# Altium schematic sheet Power_supply_CAN.SchDoc
size 420 x 297 mm; Address1: Address1; Address2: Address2; Address3: Address3; Address4: Address4; DocumentNumber: *Э3; SheetNumber: 7; SheetTotal: 15; DocumentType: Схема электрическая *
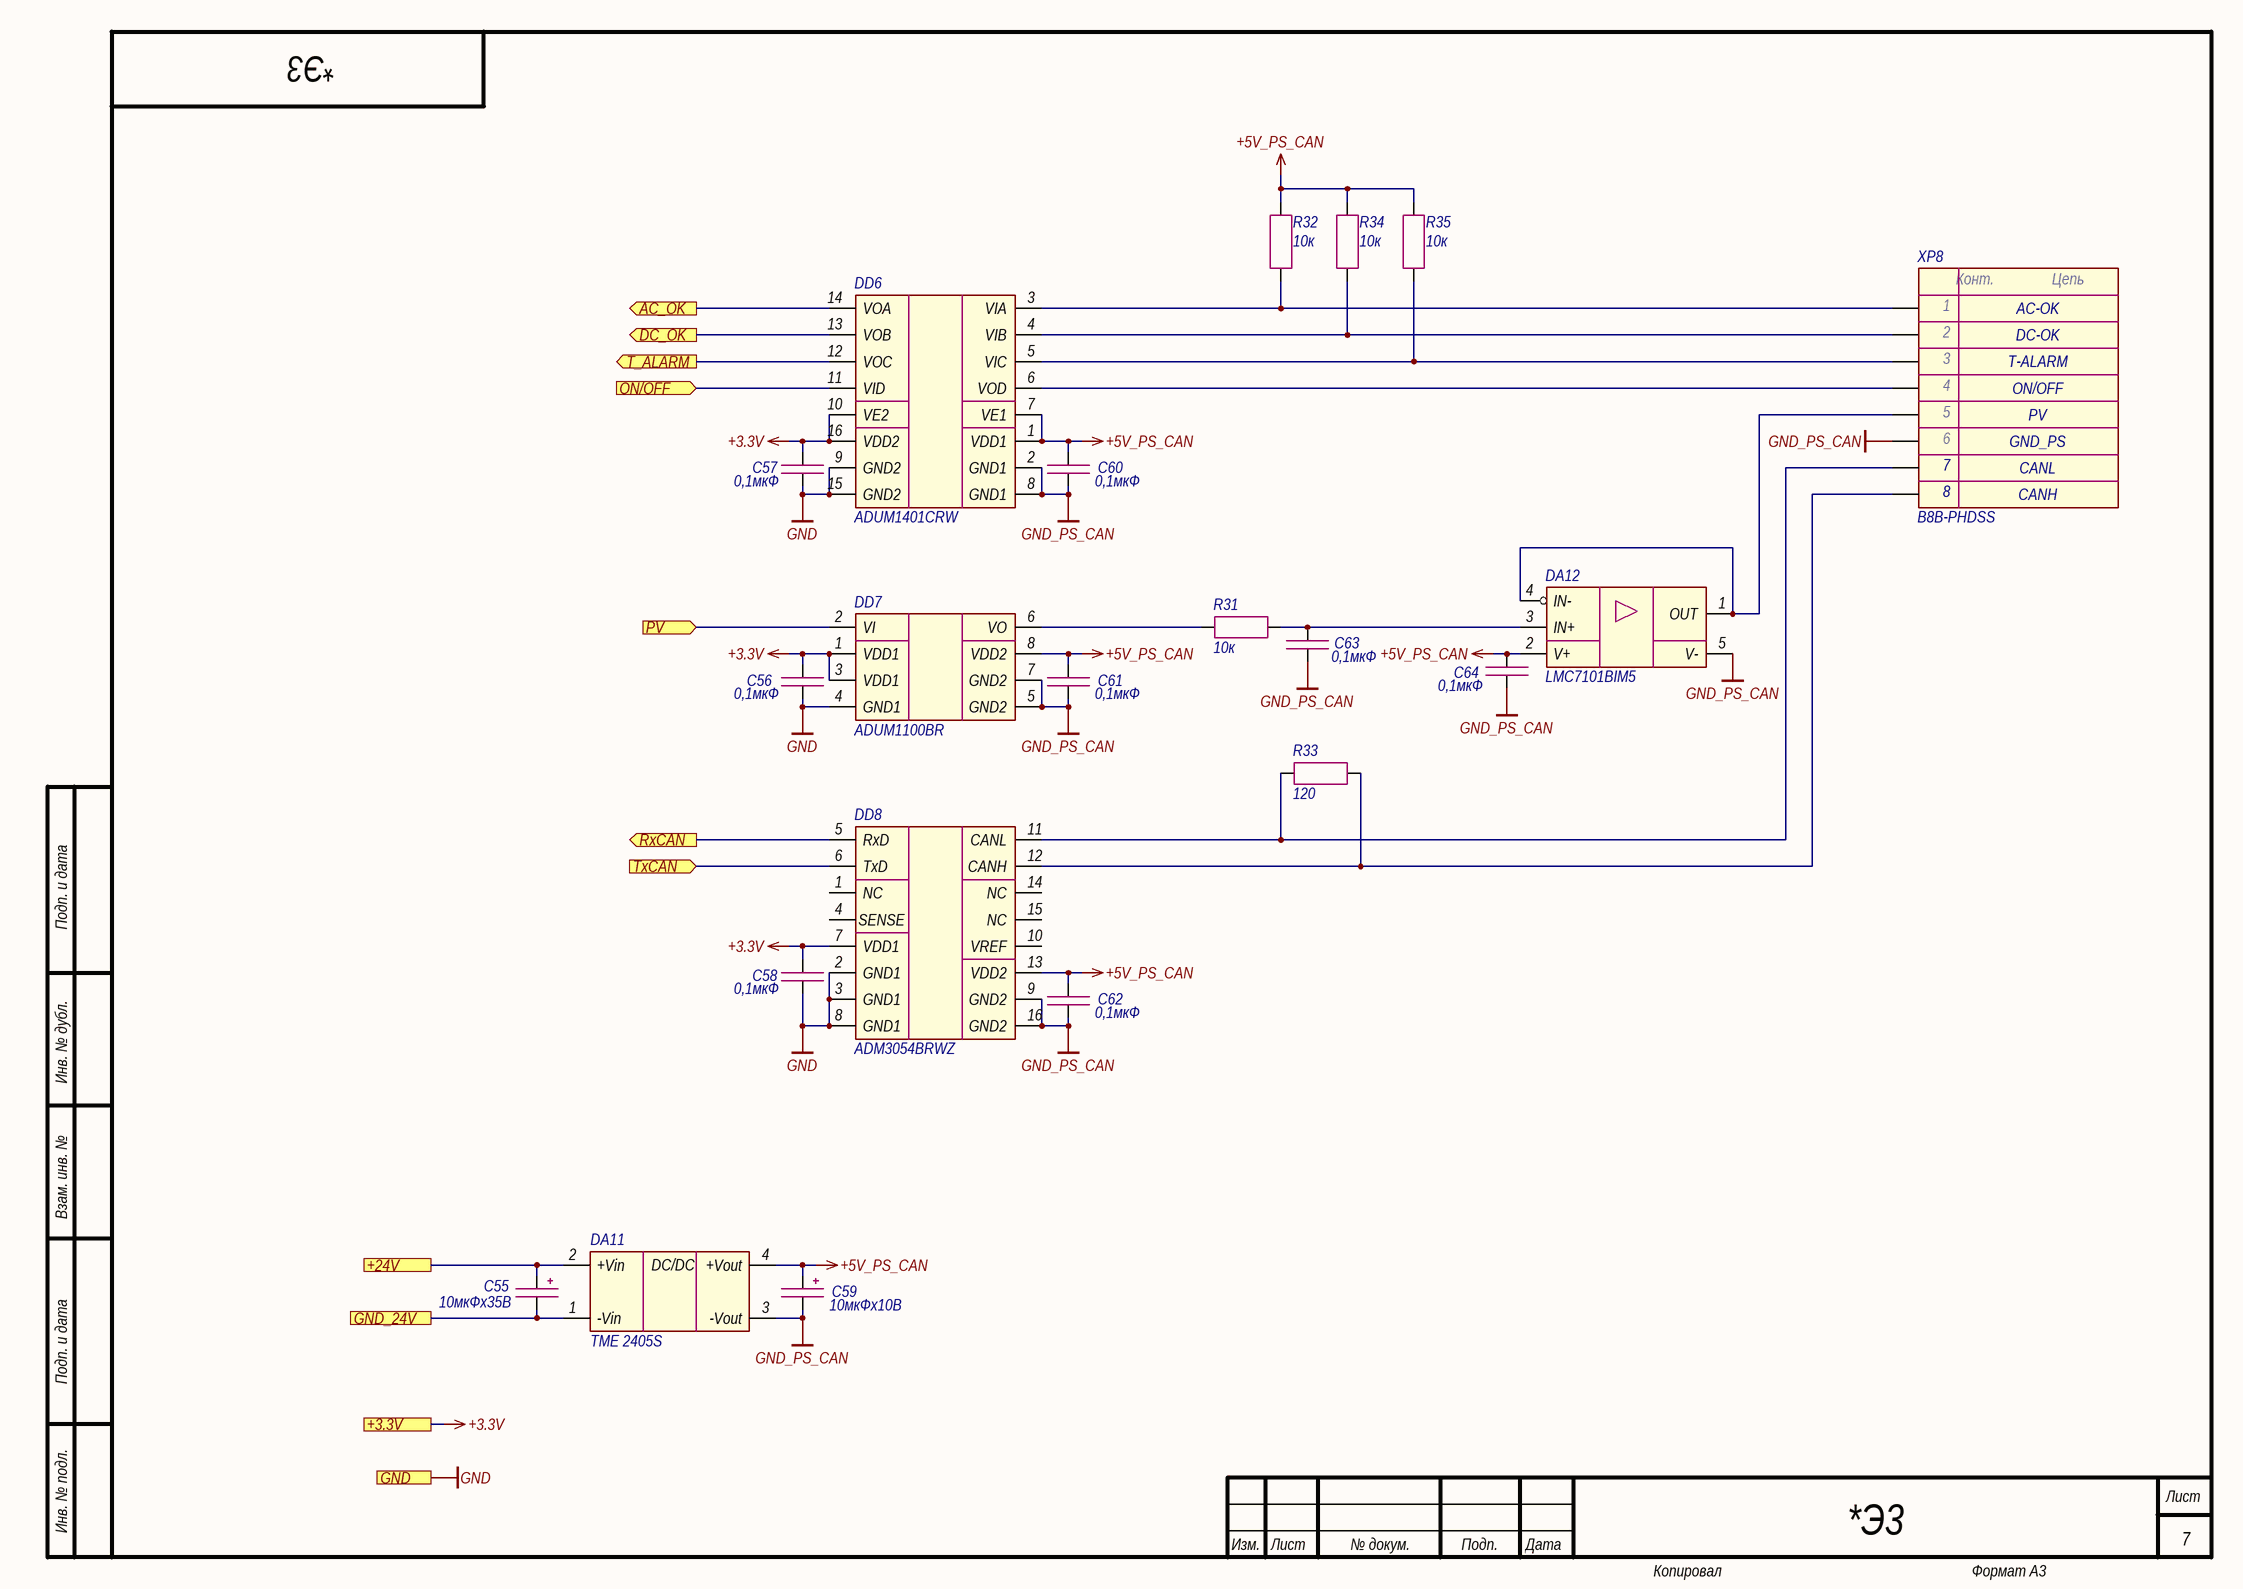
[diagram p0: Power_supply_CAN.SchDoc]

## Parts
C55  10мкФх35B  [CAP_C]
C56  0,1мкФ  [CAP_0603]
C57  0,1мкФ  [CAP_0603]
C58  0,1мкФ  [CAP_0603]
C59  10мкФх10B  [CAP_A]
C60  0,1мкФ  [CAP_0603]
C61  0,1мкФ  [CAP_0603]
C62  0,1мкФ  [CAP_0603]
C63  0,1мкФ  [CAP_0603]
C64  0,1мкФ  [CAP_0603]
DA11  TME 2405S  [TME (SIP-4)]
DA12  LMC7101BIM5  [SOT-23-5]
DD6  ADUM1401CRW  [SOIC-16W]
DD7  ADUM1100BR  [SOIC-8]
DD8  ADM3054BRWZ  [SOIC-16W]
R31  10к  [RES_0603]
R32  10к  [RES_0603]
R33  120  [RES_0805]
R34  10к  [RES_0603]
R35  10к  [RES_0603]
XP8  B8B-PHDSS  [B8B-PHDSS]

## Ports
+3.3V (see Main[2B], Button[1D], Ethernet[3D], Fiber_interlock[2C], Flow_sensor[2C], Hardwiring[3D], LD_driver[1D], Power_supply[1D], SF_driver[2C]), +24V (see Main[2C], Button[1C], Column[1C], Flow_sensor[2C], Hardwiring[3C], Indication[1C], LD_driver[1C], Power_supply[1D]), AC_OK (out, see Main[2B]), DC_OK (out, see Main[2B]), GND (see Main[2C], Button[1D], Column[1C], Ethernet[3D], Fiber_interlock[2C], Flow_sensor[2C], Guide_laser[1C], Hardwiring[3D], Indication[1C], LD_driver[1D], Power_supply[1D], SF_driver[2D]), GND_24V (see Main[2C], Button[1D], Column[1C], Flow_sensor[2C], Hardwiring[3C], Indication[1C], LD_driver[1D], Power_supply[1D]), ON/OFF (in, see Main[2B]), PV (in, see Main[2B]), RxCAN (out, see Main[2C]), T_ALARM (out, see Main[2B]), TxCAN (in, see Main[2C])

## Nets
+3.3V: C56.1 C57.1 C58.1 DD6.10(VE2) DD6.16(VDD2) DD7.1(VDD1) DD7.3(VDD1) DD8.7(VDD1) ; port +3.3V
+5V_PS_CAN: C59.1 C60.1 C61.1 C62.1 C64.1 DA11.4(+Vout) DA12.2(V+) DD6.1(VDD1) DD6.7(VE1) DD7.8(VDD2) DD8.13(VDD2) R32.1 R34.1 R35.1
GND: C56.2 C57.2 C58.2 DD6.9(GND2) DD6.15(GND2) DD7.4(GND1) DD8.2(GND1) DD8.3(GND1) DD8.8(GND1) ; port GND
GND_PS_CAN: C59.2 C60.2 C61.2 C62.2 C63.2 C64.2 DA11.3(-Vout) DA12.5(V-) DD6.2(GND1) DD6.8(GND1) DD7.5(GND2) DD7.7(GND2) DD8.9(GND2) DD8.16(GND2) XP8.6
+24V: C55.1 DA11.2(+Vin) ; port +24V
AC_OK: DD6.14(VOA) ; port AC_OK
DC_OK: DD6.13(VOB) ; port DC_OK
GND_24V: C55.2 DA11.1(-Vin) ; port GND_24V
ON/OFF: DD6.11(VID) ; port ON/OFF
PV: DD7.2(VI) ; port PV
RxCAN: DD8.5(RxD) ; port RxCAN
T_ALARM: DD6.12(VOC) ; port T_ALARM
TxCAN: DD8.6(TxD) ; port TxCAN
NetC63_1: C63.1 DA12.3(IN+) R31.2
NetDA12_1: DA12.1(OUT) DA12.4(IN-) XP8.5
NetDD6_3: DD6.3(VIA) R32.2 XP8.1
NetDD6_4: DD6.4(VIB) R34.2 XP8.2
NetDD6_5: DD6.5(VIC) R35.2 XP8.3
NetDD6_6: DD6.6(VOD) XP8.4
NetDD7_6: DD7.6(VO) R31.1
NetDD8_11: DD8.11(CANL) R33.1 XP8.7
NetDD8_12: DD8.12(CANH) R33.2 XP8.8

Not connected (* = marked no-connect by the designer): DD8 1(NC) 4(SENSE) 10(VREF) 14(NC) 15(NC)

## Notes on the sheet
- AC-OK
- DC-OK
- T-ALARM
- ON/OFF
- CANL
- GND_PS
- PV
- CANH
- Подп. и дата
- Инв. № дубл.
- Взам. инв. №
- Инв. № подл.
- Изм.
- Лист
- № докум.
- Подп.
- Дата
- Копировал
- Формат А3
- (in symbol Connector-8) Конт.; Цепь
- (in symbol TME) DC/DC

## Library data of the parts
C55 = Capacitor_Polar: Model: TECAP, 10 мкФ, 35 В, тип C, 10%; Value: 10мкФх35B; Document: *; Manufacturer: *
C56-C58 C60-C64 = Capacitor: Manufacturer: Murata; Model: GRM188R71H104KA93D; Value: 0,1мкФ; Document: *
C59 = Capacitor_Polar: Model: TECAP, 10 мкФ, 10 В, тип A, 10%; Value: 10мкФх10B; Document: *; Manufacturer: *
DA11 = TME: Manufacturer: Traco Power; Model: TME 2405S; Document: *
DA12 = LMC7101: Manufacturer: Texas Instruments; Model: LMC7101BIM5; Document: *
DD6 = ADUM1401: Manufacturer: Analog Devices; Model: ADUM1401CRW; Document: *
DD7 = ADUM1100: Manufacturer: Analog Devices; Model: ADUM1100BR; Document: *
DD8 = ADM3054BRWZ: Manufacturer: Analog Devices; Model: ADM3054BRWZ; Document: *
R31 R32 R34 R35 = Resistor: Manufacturer: Yageo; Model: RC0603FR-0710KL; Value: 10к; Document: *
R33 = Resistor: Manufacturer: Yageo; Model: RC0805FR-07120RL; Value: 120; Document: *
XP8 = Connector-8: Manufacturer: JST; Model: B8B-PHDSS; Document: *